# EAGLE schematic Colour Dectector (EAGLE 9.6.2)
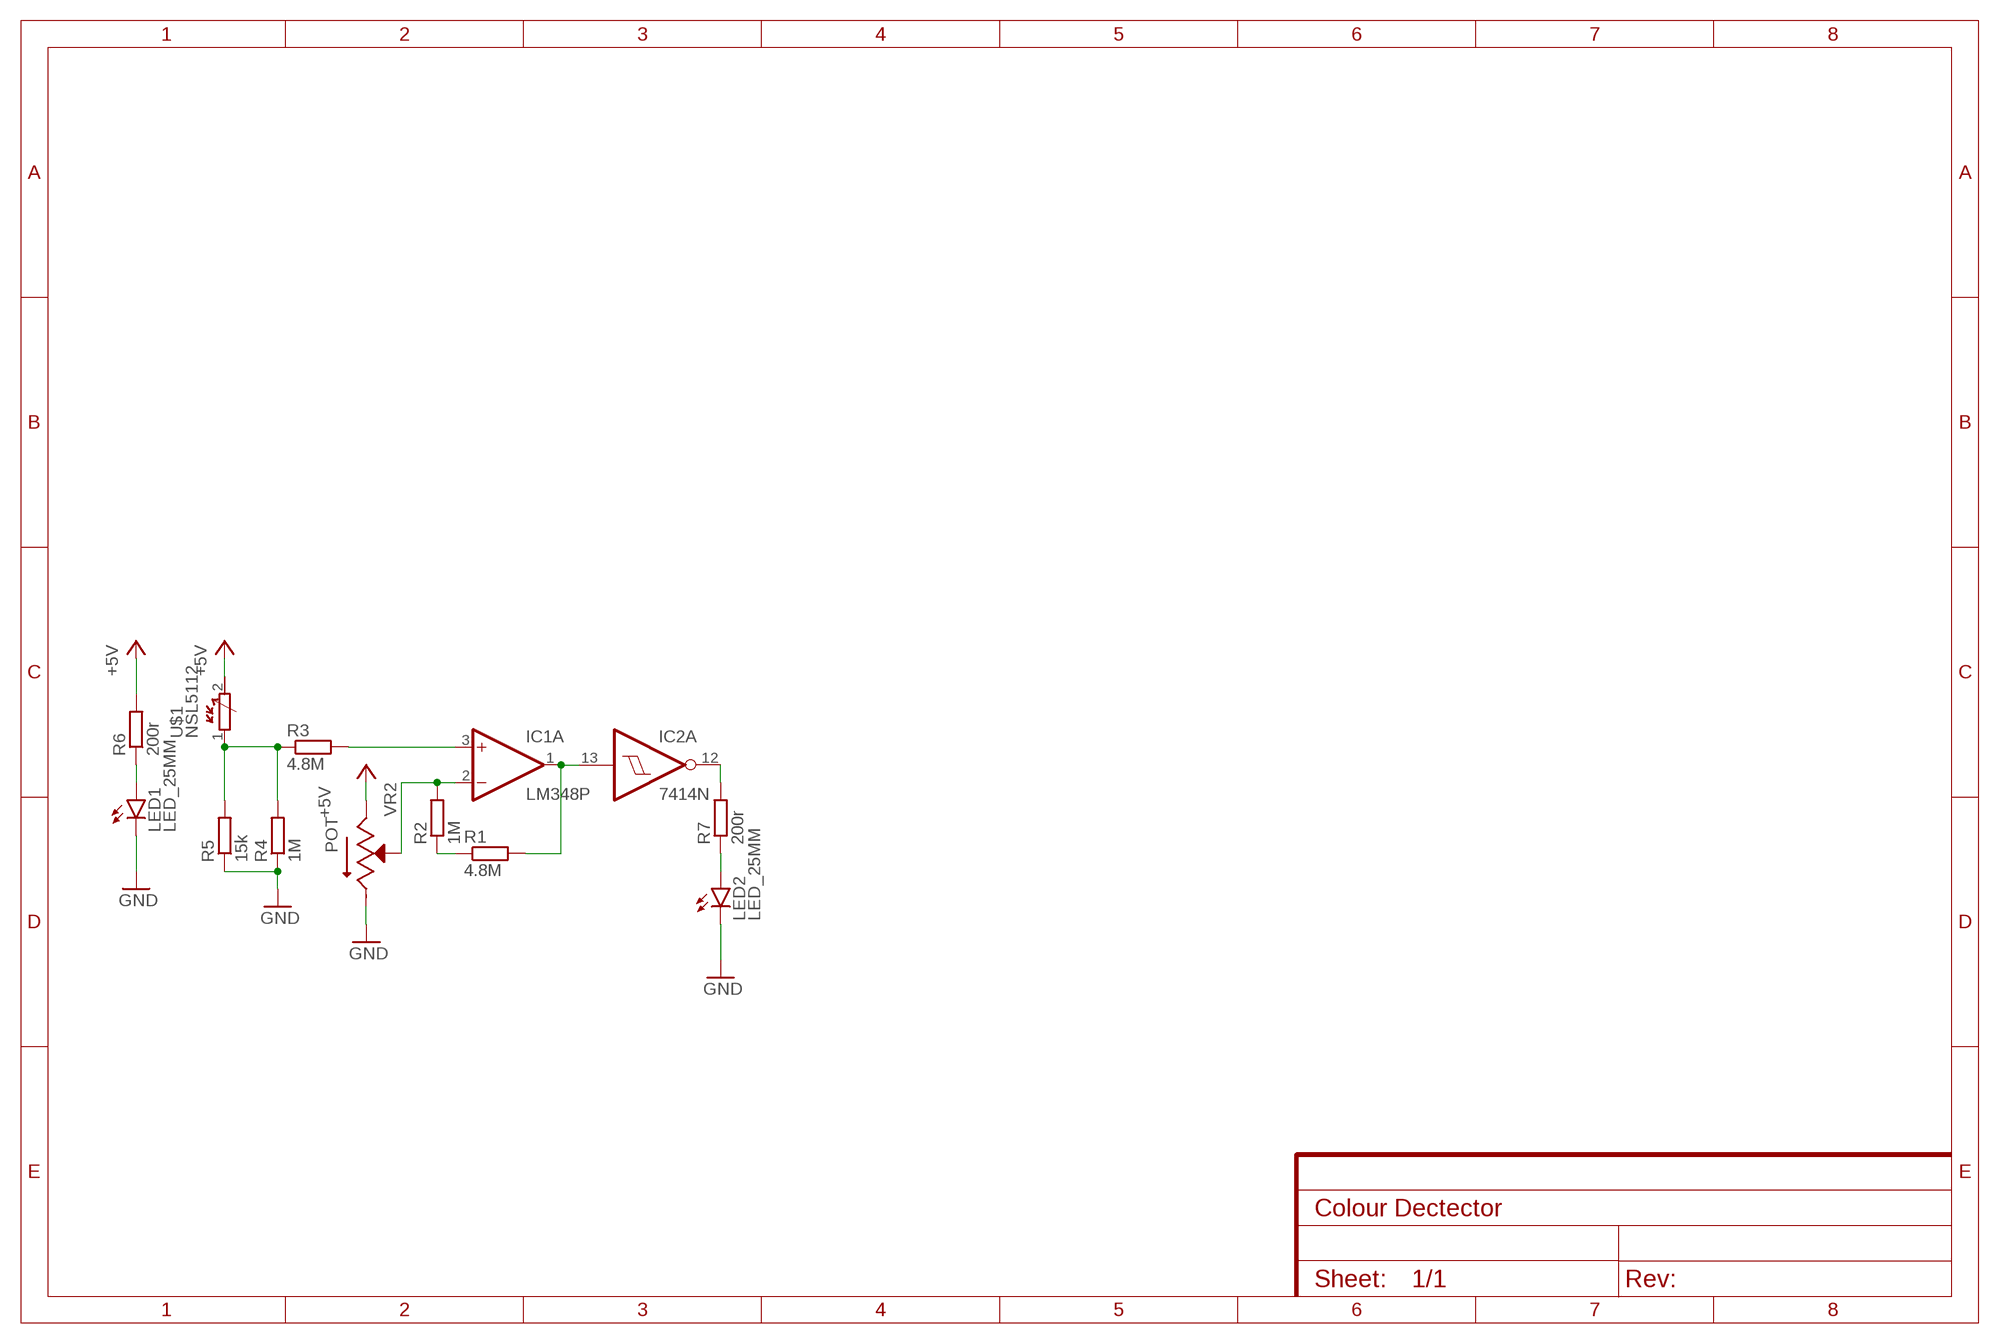
[diagram p0: schematic, sheet 1]

## Parts
IC1  LM348P  [DIL14]
IC2  7414N  [DIL14]
LED1  LED_25MM  [LED5MM]
LED2  LED_25MM  [LED5MM]
R1  4.8M  R-EU_0204/7  [0204/7]
R2  1M  R-EU_0204/7  [0204/7]
R3  4.8M  R-EU_0204/7  [0204/7]
R4  1M  R-EU_0204/7  [0204/7]
R5  15k  R-EU_0204/7  [0204/7]
R6  200r  R-EU_0204/7  [0204/7]
R7  200r  R-EU_0204/7  [0204/7]
U$1  NSL5112  [KK-156-2]
VR2  POT  [TRIM_3296W-1-250]

## Nets
+5V: R6.2 U$1.2(E) VR2.1(CCW)
GND: LED1.K(C) LED2.K(C) R4.1 R5.1 VR2.3(CW)
N$1: R1.1 R2.1
N$2: IC1.1(A:OUT) IC2.13(A:I) R1.2
N$3: IC1.2(A:-IN) R2.2 VR2.2(WIPER)
N$4: IC1.3(A:+IN) R3.2
N$5: R3.1 R4.2 R5.2 U$1.1(A)
N$6: LED1.A R6.1
N$7: IC2.12(A:O) R7.2
N$8: LED2.A R7.1
Unconnected: IC1.5(B:+IN) IC1.6(B:-IN) IC1.7(B:OUT) IC1.8(C:OUT) IC1.9(C:-IN) IC1.10(C:+IN) IC1.12(D:+IN) IC1.13(D:-IN) IC1.14(D:OUT) IC2.1(D:I) IC2.2(D:O) IC2.3(E:I) IC2.4(E:O) IC2.5(F:I) IC2.6(F:O) IC2.8(C:O) IC2.9(C:I) IC2.10(B:O) IC2.11(B:I)

## Power pins joined to a net without a drawn wire
GND: IC2.7(P:GND)
V+: IC1.4(P:V+)
V-: IC1.11(P:V-)
VCC: IC2.14(P:VCC)

## Library data of the parts
IC1 = IDP_library:LM348: Quad OP AMP
IC2 = IDP_library:74*14: Hex schmitt trigger INVERTER
LED1 LED2 = IDP_library:LED_2: LED
R1-R7 = IDP_library:R-EU_: RESISTOR, European symbol; SPICEPREFIX: R
U$1 = IDP_library:NSL5112
VR2 = IDP_library:POT: Res Cermet Trimmer 500K Ohm 10% 0.5W 25(Elec)Turn 2.19mm (9.53 X 4.83 X 11.55mm) Pin Thru-Hole Tube; AVAILABILITY: Unavailable; DESCRIPTION: Trimpot 25 Ohm 3/8 Sq Cer Mt; MF: Bourns; MP: 3296W-1-250; PACKAGE: SOT-23-5 Bourns; PRICE: None